# EAGLE schematic single_in_array_wth_para (EAGLE 9.3.0)
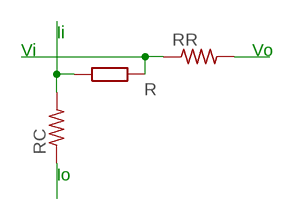
[diagram p0: schematic, sheet 1]

## Parts
R  R-EU_0204/2V  [0204V]
RC  R-US_0204/2V  [0204V]
RR  R-US_0204/2V  [0204V]

## Nets
II: R.1 RC.2
IO: RC.1
VI: R.2 RR.1
VO: RR.2

## Notes on the sheet
- Ii
- Vi | Vo
- Io

## Library data of the parts
R = resistor:R-EU_: RESISTOR, European symbol
RC RR = resistor:R-US_: RESISTOR, American symbol